# Altium schematic sheet Keypadmacro.SchDoc
size 419 x 297 mm
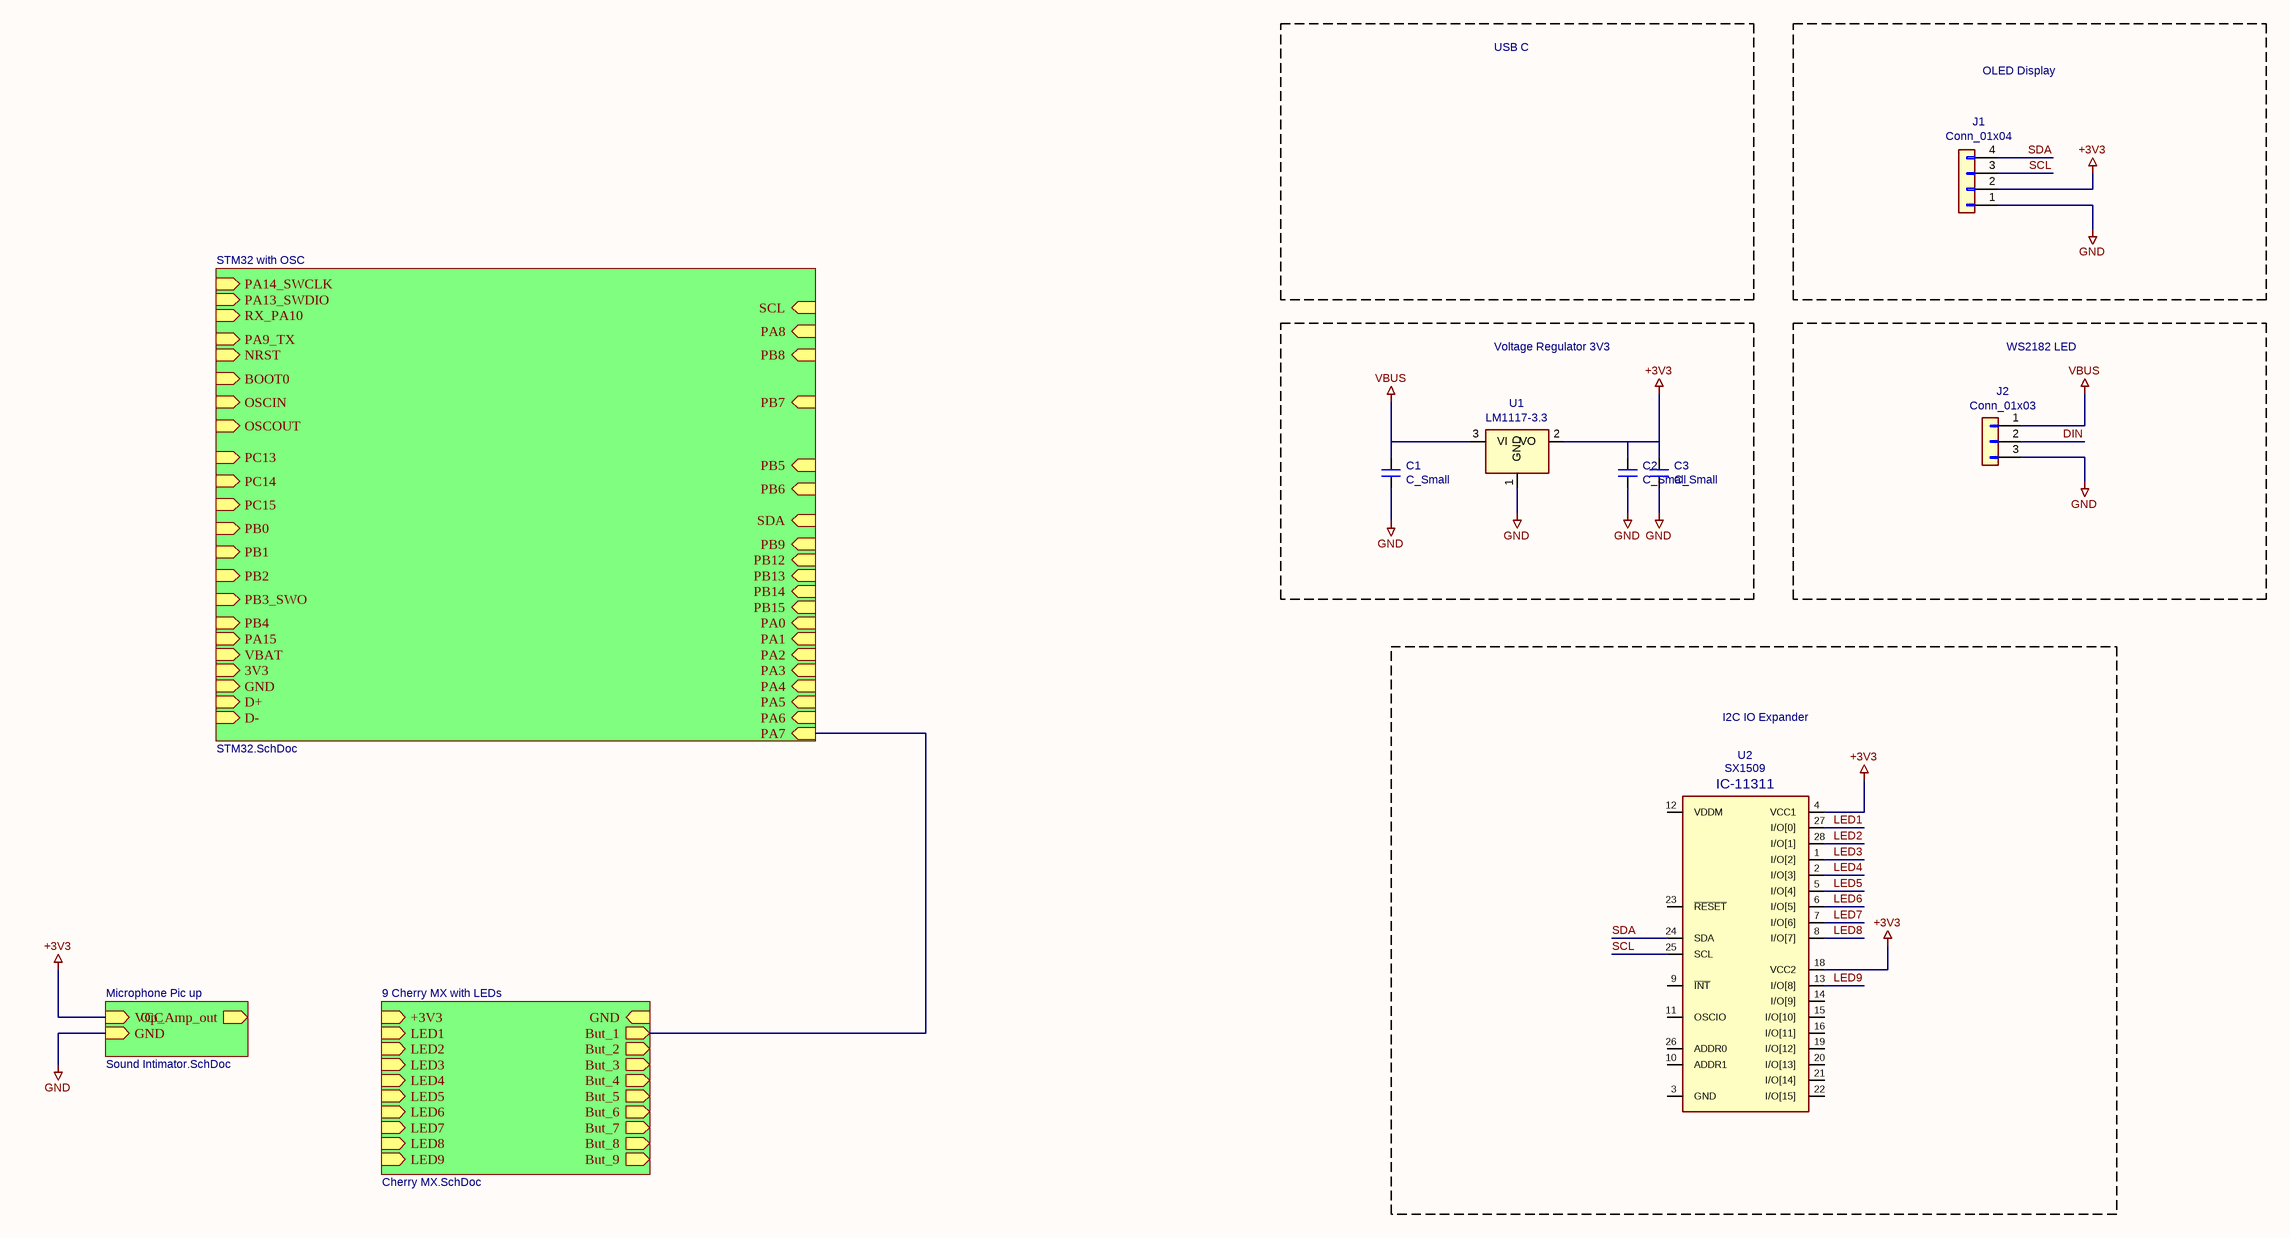
[diagram p0: Keypadmacro.SchDoc]

## Parts
C1  C_Small
C2  C_Small
C3  C_Small
J1  Conn_01x04
J2  Conn_01x03
U1  LM1117-3.3
U2  Field4: IC-11311  [QFN-28]  (hidden comment: SX1509)

## Blocks framed on the sheet
OLED Display: J1
Voltage Regulator 3V3: C1-C3 U1
WS2182 LED: J2
I2C IO Expander: U2

## Sub-sheets
9 Cherry MX with LEDs = Cherry MX.SchDoc: But_1 (out), But_2 (out), But_3 (out), But_4 (out), But_5 (out), But_6 (out), But_7 (out), But_8 (out), But_9 (out), LED1 (in), LED2 (in), LED3 (in), LED6 (in), LED9 (in), LED4 (in), LED5 (in), LED8 (in), LED7 (in), +3V3 (in), GND (in)
Microphone Pic up = Sound Intimator.SchDoc: VCC (in), GND (in), Op_Amp_out (out)
STM32 with OSC = STM32.SchDoc: NRST (in), BOOT0 (in), OSCIN (in), OSCOUT (in), PC13 (in), PC14 (in), PC15 (in), PB0 (in), PB1 (in), PB2 (in), PB3_SWO (in), PB4 (in), PB5 (in), PB6 (in), PB7 (in), PB8 (in), SCL (in), SDA (in), PB9 (in), PB12 (in), PB13 (in), PB14 (in), PB15 (in), PA0 (in), PA1 (in), PA2 (in), PA3 (in), PA4 (in), PA5 (in), PA6 (in), PA7 (in), PA8 (in), PA9_TX (in), RX_PA10 (in), PA13_SWDIO (in), PA14_SWCLK (in), PA15 (in), VBAT (in), 3V3 (in), GND (in), D+ (in), D- (in)

## Nets
+3V3: C2.1 C3.1 J1.2(Pin_2) U1.2(VO) U2.4(VCC1) U2.18(VCC2) ; sheet Microphone Pic up/VCC
GND: C1.2 C2.2 C3.2 J1.1(Pin_1) J2.3(Pin_3) U1.1(GND) ; sheet Microphone Pic up/GND
VBUS: C1.1 J2.1(Pin_1) U1.3(VI)
DIN: J2.2(Pin_2)
LED1: U2.27(I/O[0])
LED2: U2.28(I/O[1])
LED3: U2.1(I/O[2])
LED4: U2.2(I/O[3])
LED5: U2.5(I/O[4])
LED6: U2.6(I/O[5])
LED7: U2.7(I/O[6])
LED8: U2.8(I/O[7])
LED9: U2.13(I/O[8])
SCL: J1.3(Pin_3) U2.25(SCL)
SDA: J1.4(Pin_4) U2.24(SDA)
(unnamed): sheet 9 Cherry MX with LEDs/But_1, sheet STM32 with OSC/PA7

Not connected (* = marked no-connect by the designer): U2 3(GND) 9(~{INT}) 10(ADDR1) 11(OSCIO) 12(VDDM) 14(I/O[9]) 15(I/O[10]) 16(I/O[11]) 17(GND) 19(I/O[12]) 20(I/O[13]) 21(I/O[14]) 22(I/O[15]) 23(~{RESET}) 26(ADDR0) 29(GND)

## Notes on the sheet
- USB C
- 1
- 2
- 3
- 4
- 5
- 6
- 7
- 8
- A
- B
- C
- D
- E
- Title:
- File: Keypadmacro.sch
- Sheet: /
- F
- KiCad E.D.A.  kicad (5.1.4)-1
- Size: A3
- Date:
- Rev:
- Id: 1/4

## Library data of the parts
C1-C3 = C_Small: Value: C_Small
J1 = Conn_01x04: Value: Conn_01x04
J2 = Conn_01x03: Value: Conn_01x03
U1 = LM1117-3.3: Value: LM1117-3.3
U2 = SX1509: Value: SX1509